# Altium schematic sheet Multiplexer Bank.SchDoc
size A4
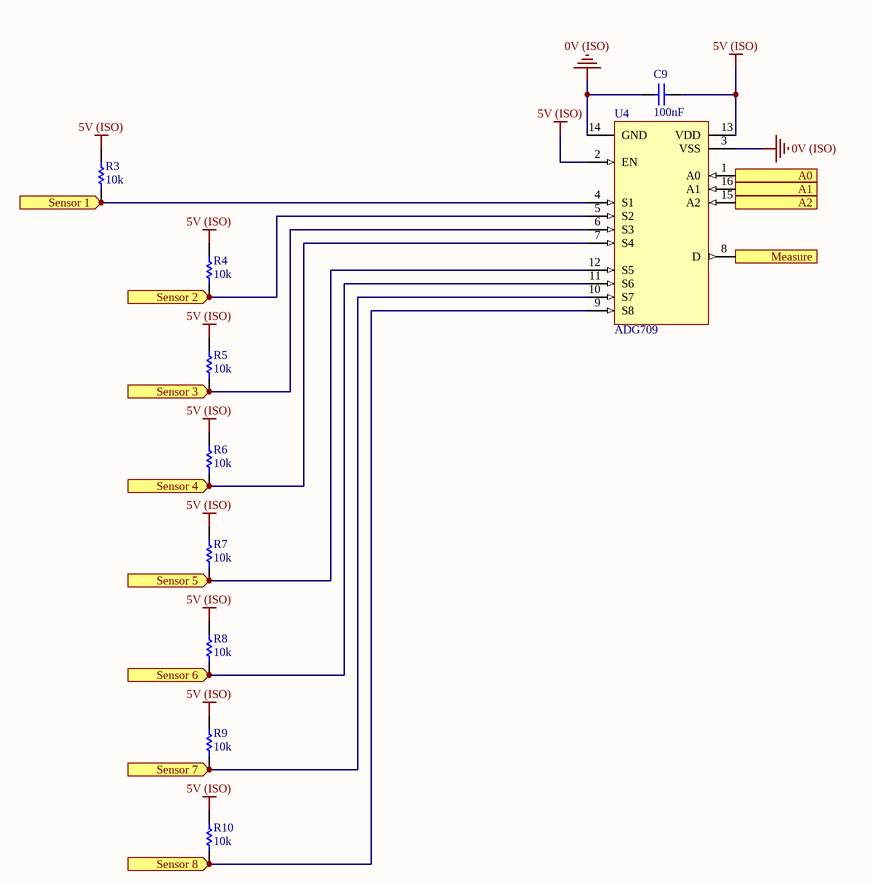
[diagram p0: Multiplexer Bank.SchDoc]

## Parts
C9  100nF  Tolerance: 10%  Material: X7R  Rated Voltage: 25V  [0805]
R3  10k  [0805]
R4  10k  [0805]
R5  10k  [0805]
R6  10k  [0805]
R7  10k  [0805]
R8  10k  [0805]
R9  10k  [0805]
R10  10k  [0805]
U4  ADG709  [AD 16-TSSOP]

## Ports
A0 (in), A1 (in), A2 (in), Measure (out), Sensor 1 (in), Sensor 2 (in), Sensor 3 (in), Sensor 4 (in), Sensor 5 (in), Sensor 6 (in), Sensor 7 (in), Sensor 8 (in)

## Nets
0V (ISO): C9.1 U4.3(VSS) U4.14(GND)
5V (ISO): C9.2 R3.2 R4.2 R5.2 R6.2 R7.2 R8.2 R9.2 R10.2 U4.2(EN) U4.13(VDD)
A0: U4.1(A0) ; port A0
A1: U4.16(A1) ; port A1
A2: U4.15(A2) ; port A2
Measure: U4.8(D) ; port Measure
Sensor 1: R3.1 U4.4(S1) ; port Sensor 1
Sensor 2: R4.1 U4.5(S2) ; port Sensor 2
Sensor 3: R5.1 U4.6(S3) ; port Sensor 3
Sensor 4: R6.1 U4.7(S4) ; port Sensor 4
Sensor 5: R7.1 U4.12(S5) ; port Sensor 5
Sensor 6: R8.1 U4.11(S6) ; port Sensor 6
Sensor 7: R9.1 U4.10(S7) ; port Sensor 7
Sensor 8: R10.1 U4.9(S8) ; port Sensor 8

## Library data of the parts
C9 = GCM21BR71E104KA37L: Manufacturer: muRata; Value: 100nF; Part Number: GCM21BR71E104KA37L
R3-R10 = RC0805FR0710KL: Manufacturer: YAGEO; Tolerance: 0.01; Rated Voltage: 0.125W; Part Number: RC0805FR0710KL; Value: 10k; Material: FR-07; qty: 50
U4 = ADG709: 2 Circuit IC Switch 4:1 4.5 Ohm 16-TSSOP; Manufacturer: Analogue Devices; Part Number: ADG709; Digikey Part Number: ADG709CRUZ-REEL7TR-ND; Digikey Link: https://www.digikey.com/product-detail/en/analog-devices-inc/ADG709CRUZ-REEL7/ADG709CRUZ-REEL7TR-ND/995219